# EAGLE design WEMOS_ESP8266_AktorShield (EAGLE 7.7.0)
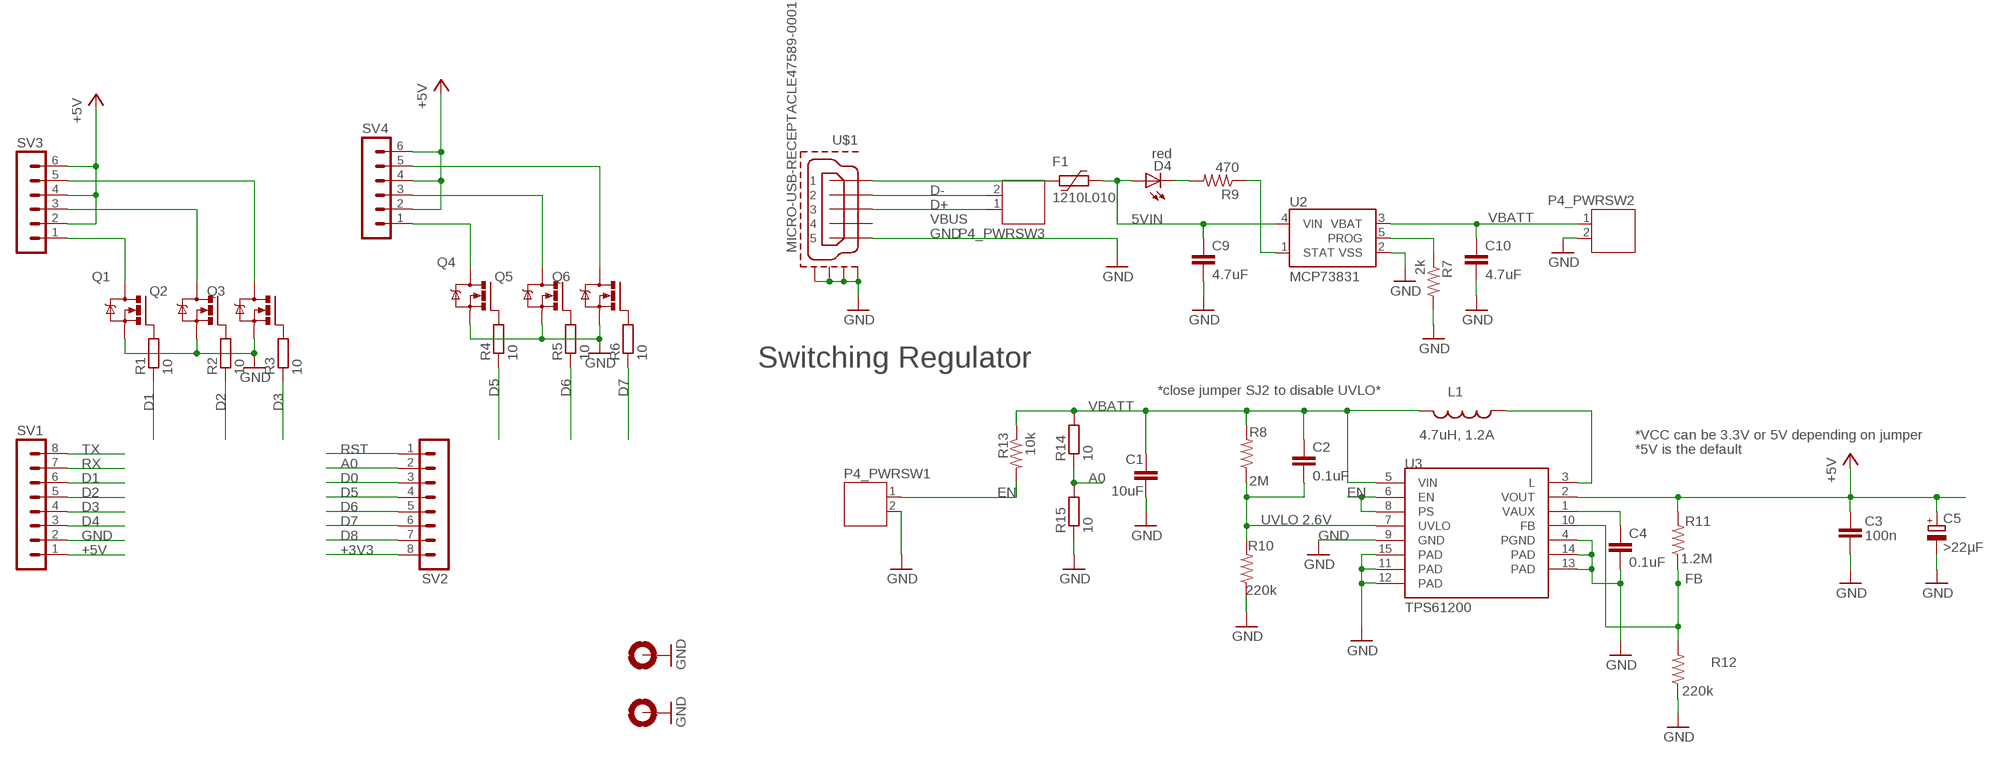
[diagram p0: schematic, sheet 1]

## Parts
C1  10uF  CAP1206  [1206]
C2  0.1uF  CAP0603-CAP  [0603-CAP]
C3  100n  CAP0805  [0805]
C4  0.1uF  CAP0603-CAP  [0603-CAP]
C5  >22µF  CPOL-EUSMCC  [SMC_C]
C9  4.7uF  CAP0603-CAP  [0603-CAP]
C10  4.7uF  CAP0603-CAP  [0603-CAP]
D4  red  LED0603  [LED-0603]
F1  1210L010  [1210L]
H7  MOUNT-PAD-ROUND3.6  [3,6-PAD]
H8  MOUNT-PAD-ROUND3.6  [3,6-PAD]
L1  4.7uH, 1.2A  INDUCTOR.  [CDRH2D09]
P4_PWRSW1  JST-PH2  [JST-PH2]
P4_PWRSW2  JST-PH2  [JST-PH2]
P4_PWRSW3  JST-PH2  [JST-PH2]
Q1  IRLML6344  [SOT23]
Q2  IRLML6344  [SOT23]
Q3  IRLML6344  [SOT23]
Q4  IRLML6344  [SOT23]
Q5  IRLML6344  [SOT23]
Q6  IRLML6344  [SOT23]
R1  10  R-EU_R0603  [R0603]
R2  10  R-EU_R0603  [R0603]
R3  10  R-EU_R0603  [R0603]
R4  10  R-EU_R0603  [R0603]
R5  10  R-EU_R0603  [R0603]
R6  10  R-EU_R0603  [R0603]
R7  2k  RESISTOR0603-RES  [0603-RES]
R8  2M  RESISTOR0603-RES  [0603-RES]
R9  470  RESISTOR0603-RES  [0603-RES]
R10  220k  RESISTOR0603-RES  [0603-RES]
R11  1.2M  RESISTOR0603-RES  [0603-RES]
R12  220k  RESISTOR0603-RES  [0603-RES]
R13  10k  RESISTOR0603-RES  [0603-RES]
R14  10  R-EU_R0603  [R0603]
R15  10  R-EU_R0603  [R0603]
SV1  MA08-1SMALL  [MA08-1S]
SV2  MA08-1SMALL  [MA08-1S]
SV3  MA06-1  [MA06-1]
SV4  MA06-1  [MA06-1]
U2  MCP73831  [SOT23-5]
U3  TPS61200  [QFN-10_PAD]
U$1  MICRO-USB-RECEPTACLE47589-0001  [47589-0001]

## Nets
5VIN: C9.1 D4.A F1.1 U2.4(VIN)
+3V3: SV2.8
+5V: C3.1 C5.+ R11.2 SV1.1 SV3.2 SV3.4 SV3.6 SV4.2 SV4.4 SV4.6 U3.2(VOUT)
A0: R14.1 R15.2 SV2.2
D0: SV2.3
D1: R1.1 SV1.6
D2: R2.1 SV1.5
D3: R3.1 SV1.4
D4: SV1.3
D5: R4.1 SV2.4
D6: R5.1 SV2.5
D7: R6.1 SV2.6
D8: SV2.7
D+: P4_PWRSW3.1 U$1.3
D-: P4_PWRSW3.2 U$1.2
EN: P4_PWRSW1.1 R13.2 U3.6(EN) U3.8(PS)
FB: R11.1 R12.2 U3.10(FB)
GND: C1.2 C3.2 C4.2 C5.- C9.2 C10.2 H7.B3,6(MOUNT) H8.B3,6(MOUNT) P4_PWRSW1.2 P4_PWRSW2.2 Q1.2(S) Q2.2(S) Q3.2(S) Q4.2(S) Q5.2(S) Q6.2(S) R7.2 R10.1 R12.1 R15.1 SV1.2 U2.2(VSS) U3.4(PGND) U3.9(GND) U3.11(PAD) U3.12(PAD) U3.13(PAD) U3.14(PAD) U3.15(PAD) U$1.5 U$1.CASING1(GND1) U$1.CASING2(GND2) U$1.CASING3(GND3) U$1.CASING4(GND4)
N$1: Q1.1(G) R1.2
N$2: Q2.1(G) R2.2
N$3: Q3.1(G) R3.2
N$4: Q3.3(D) SV3.5
N$5: Q1.3(D) SV3.1
N$6: Q2.3(D) SV3.3
N$7: Q4.1(G) R4.2
N$8: Q5.1(G) R5.2
N$9: Q6.1(G) R6.2
N$10: Q4.3(D) SV4.1
N$11: Q5.3(D) SV4.3
N$12: Q6.3(D) SV4.5
N$13: R7.1 U2.5(PROG)
N$14: R9.1 U2.1(STAT)
N$15: D4.C R9.2
N$16: L1.P$1 U3.3(L)
N$17: C4.1 U3.1(VAUX)
RST: SV2.1
RX: SV1.7
TX: SV1.8
UVLO: C2.2 R8.1 R10.2 U3.7(UVLO)
VBATT: C1.1 C2.1 C10.1 L1.P$2 P4_PWRSW2.1 R8.2 R13.1 R14.2 U2.3(VBAT) U3.5(VIN)
VBUS: F1.2 U$1.1
Unconnected: U$1.4

## Notes on the sheet
- Switching Regulator
- *close jumper SJ2 to disable UVLO*
- *VCC can be 3.3V or 5V depending on jumper
- *5V is the default
- UVLO 2.6V

## Library data of the parts
C1 = CH_passive:CAP: Capacitor Standard 0603 ceramic capacitor, and 0.1" leaded capacitor.; MF: KEMET; MPN: C1206C106K8RACTU; OC_FARNELL: 1288264
C2 C4 = SparkFun:CAP: Capacitor Standard 0603 ceramic capacitor, and 0.1" leaded capacitor.; MF: YAGEO (PHYCOMP); MPN: CC0603MRY5V9BB104; OC_FARNELL: 431989
C3 = CH_passive:CAP: Capacitor Standard 0603 ceramic capacitor, and 0.1" leaded capacitor.; MF: YAGEO (PHYCOMP); MPN: CC0603MRY5V9BB104; OC_FARNELL: 431989
C5 = rcl:CPOL-EU: POLARIZED CAPACITOR, European symbol
C9 C10 = SparkFun:CAP: Capacitor Standard 0603 ceramic capacitor, and 0.1" leaded capacitor.; MF: KEMET; MPN: C0603C475K8PACTU; OC_FARNELL: 1572625
D4 = SparkFun:LED: LEDs Standard schematic elements and footprints for 5mm, 3mm, 1206, and 0603 sized LEDs. 5mm - Spark Fun Electronics SKU : COM-00529 (and others); MF: OSRAM; MPN: LSQ976-Z; OC_FARNELL: 1226390
F1 = polyfuse-smd_10:?: Polyfuse Resettable PTC Source: http://www.littelfuse.com/products/resettable-ptcs.aspx; MF: LITTELFUSE; MPN: 1210L010WR; OC_FARNELL: 1822206; OC_NEWARK: 18M4781
H7 H8 = holes_new:MOUNT-PAD-ROUND: MOUNTING PAD, round; OC_FARNELL: unknown
L1 = SparkFun:INDUCTOR: Inductors Basic Inductor/Choke - 0603 and 1206. Footprints are not proven and vary greatly between part numbers.; MF: MURATA; MPN: LQH3NPN4R7MJ0L; OC_FARNELL: 2219271
P4_PWRSW1-P4_PWRSW3 = jst-ph:JST-PH2; MF: JST (JAPAN SOLDERLESS TERMINALS); MPN: B2B-PH-K-S(LF)(SN); OC_FARNELL: 9491856
Q1-Q6 = myDBv7:IRLML6344; MF: INFINEON; MPN: IRLML6344TRPBF; OC_FARNELL: 1857299
R1-R6 R14 R15 = rcl:R-EU_: RESISTOR, European symbol; MF: VISHAY; MPN: CRCW060310R0FKEA; OC_FARNELL: 1469751
R7 = SparkFun:RESISTOR: Resistor Basic schematic elements and footprints for 0603, 1206, and PTH resistors.; MF: YAGEO (PHYCOMP); MPN: RC0603FR-072K2L.; OC_FARNELL: 9238522
R8 = SparkFun:RESISTOR: Resistor Basic schematic elements and footprints for 0603, 1206, and PTH resistors.; MF: KOA SPEER ELECTRONICS; MPN: RK73H1JTTD1204F; OC_FARNELL: 1811595
R9 = SparkFun:RESISTOR: Resistor Basic schematic elements and footprints for 0603, 1206, and PTH resistors.; MF: MULTICOMP; MPN: MCHP03W8F4700T5E; OC_FARNELL: 1576273
R10 R12 = SparkFun:RESISTOR: Resistor Basic schematic elements and footprints for 0603, 1206, and PTH resistors.; MF: MULTICOMP; MPN: MCHP03W8F2203T5E; OC_FARNELL: 1576314
R11 = SparkFun:RESISTOR: Resistor Basic schematic elements and footprints for 0603, 1206, and PTH resistors.; MF: MULTICOMP; MPN: MCMR06W2004FTL; OC_FARNELL: 2073340
R13 = SparkFun:RESISTOR: Resistor Basic schematic elements and footprints for 0603, 1206, and PTH resistors.; MF: MULTICOMP; MPN: MCMR06X1002FTL; OC_FARNELL: 2073349
SV1 SV2 = con-pin-header:MA08-1: PIN HEADER; OC_FARNELL: unknown
SV3 SV4 = con-pin-header:MA06-1: PIN HEADER; OC_FARNELL: unknown
U2 = SparkFun:MCP73831: Microchip's MCP73831 Miniature single cell, fully integrated Li-Ion, Li-polymer charge management controller http://ww1.microchip.com/downloads/en/DeviceDoc/21984a.pdf; MF: MICROCHIP; MPN: MCP73831T-2ACI/OT; OC_FARNELL: 1332158
U3 = SparkFun:TPS61200: DC to DC Booster; MF: TEXAS INSTRUMENTS; MPN: TPS61200DRCT; OC_FARNELL: 1471238
U$1 = con-molex-usb:MICRO-USB-RECEPTACLE: MICRO USB RECEPTACLES Micro-USB Receptacles, SMT, Lead-Free from MOLEX <http://www.molex.com/>. (C) 2014 Tomasz Boleslaw CEDRO, cederom@tlen.pl, http://www.tomek.cedro.info. Version 0.1 (2014-01-17): Initial release. Version 0.2 (2014-02-06): Updated 47589-0001 footprint pins/pads/milling. Following devices are included: 1. 47589-0001 Micro-USB AB Receptacle, Bottom Mount, SMT, Lead-Free <http://www.molex.com/molex/products/datasheet.jsp?part=active/0475890001_IO_CONNECTORS.xml> (Technical Drawing <http://www.molex.com/pdm_docs/sd/475890001_sd.pdf>).; MF: MOLEX; MPN: 47589-0001; OC_FARNELL: 1568023

## Board
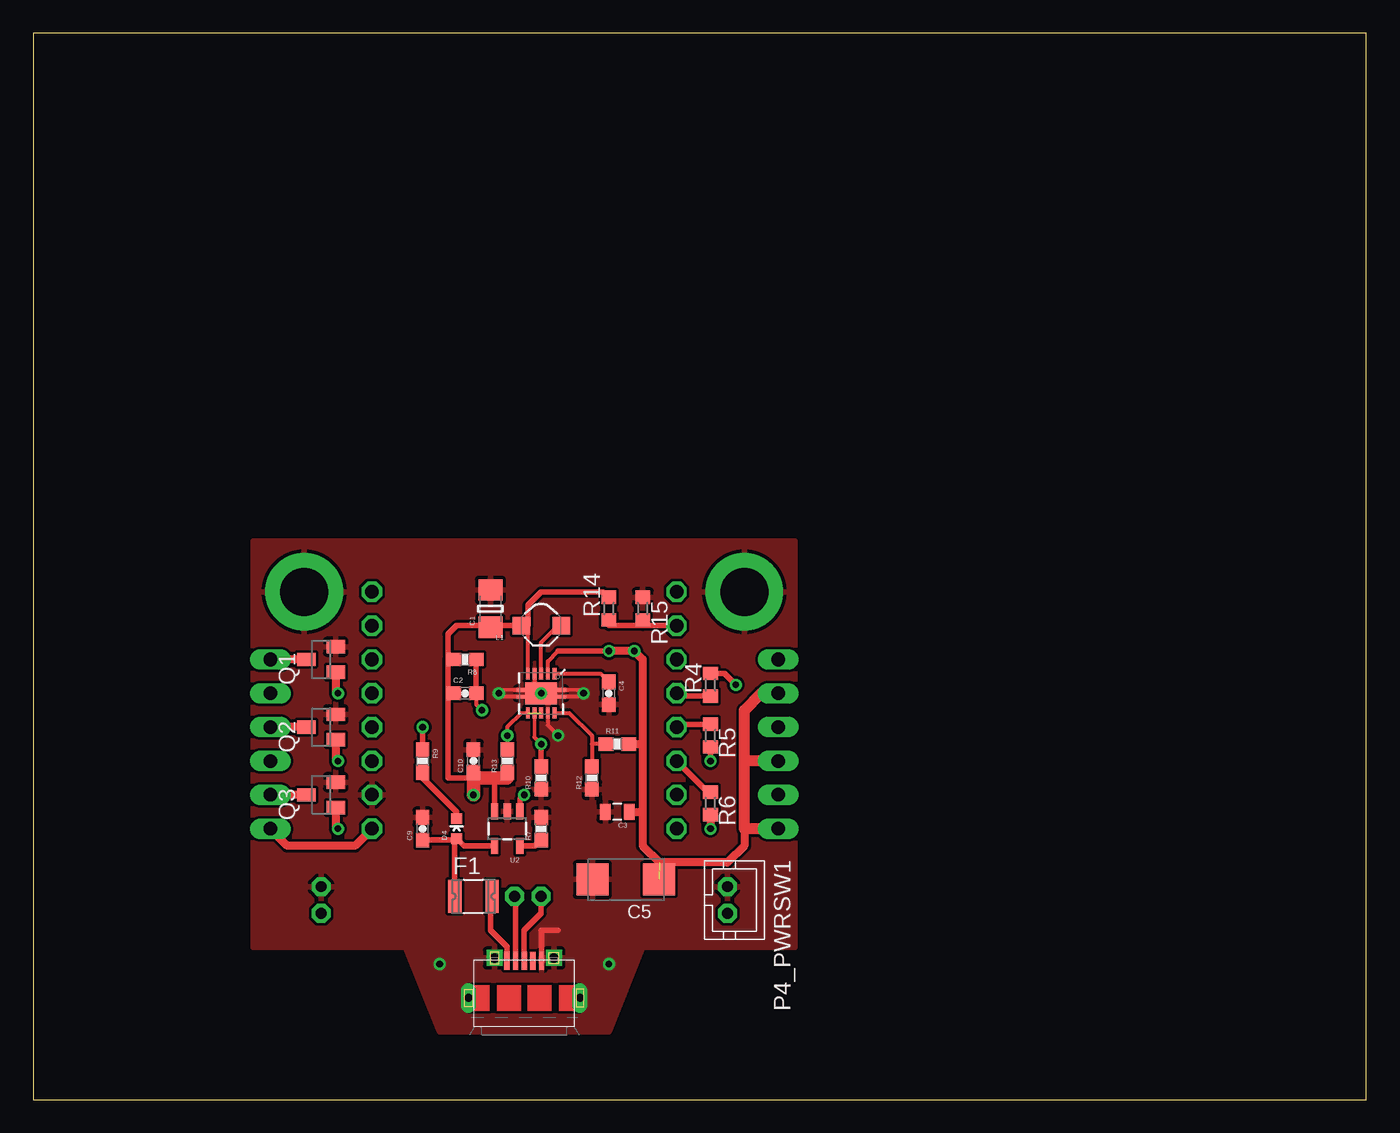
[diagram p1: board, top side]
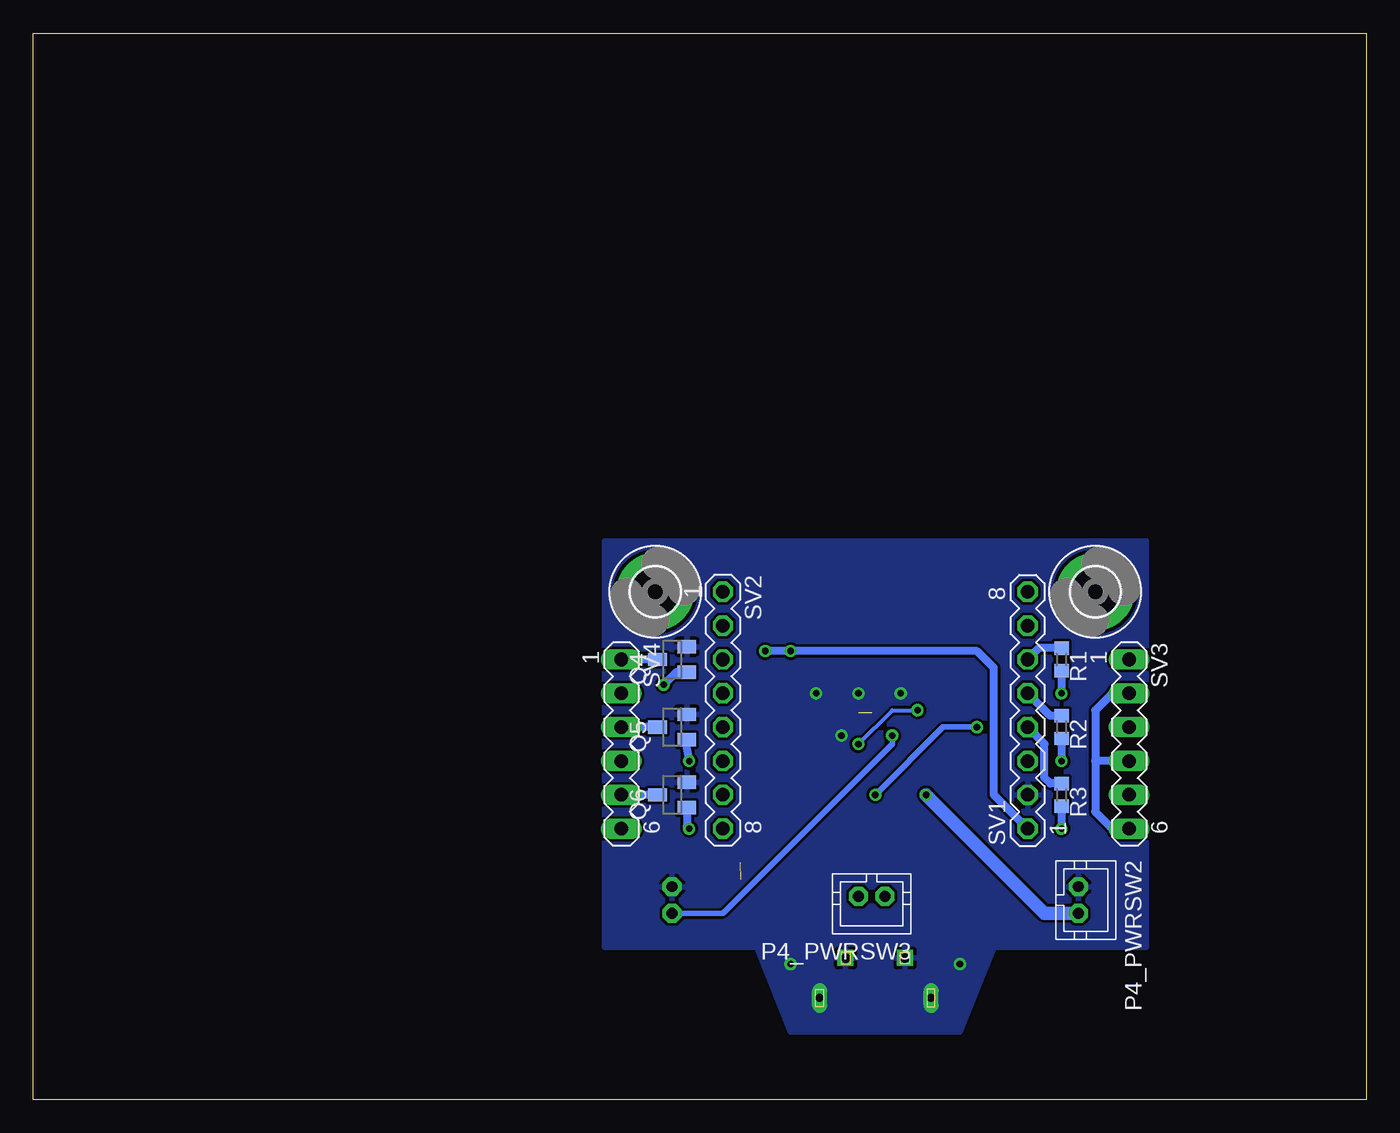
[diagram p2: board, bottom side, seen from below]

Size 100 x 80 mm. Coordinates in mm from the lower left corner, seen from the top.
Outline: 0,0 100,0 100,80 0,80 0,0
Copper layers (1*16): Top 0.035mm / dielectric 1.5mm / Bottom 0.035mm
Design rules "default": minimum track width 10mil, minimum drill 0.6mm, track to track 8mil, track to pad 8mil, pad to pad 8mil, via to via 8mil, smd to smd 8mil, copper to edge 40mil, drill to drill 8mil, minimum pad ring 10mil, minimum via ring 8mil, stop-mask expansion 4mil, vias tented up to drill 0mil, thermal gap 10mil

### Footprints (pad centres in the part's own frame; a part is rotated, then mirrored left to right if it is on the bottom)
1206 = smd 1.6 x 1.8: 1 -1.4,0; 2 1.4,0
0603-CAP = smd 1.1 x 1: 1 -0.85,0; 2 0.85,0
0805 = smd 0.8 x 1.2: 1 -0.9,0; 2 0.9,0
SMC_C = smd 2.4 x 2.4: + -2.5,0; - 2.5,0
LED-0603 = smd 0.8 x 0.8: A 0,-0.75; C 0,0.75
1210L = smd 1 x 2.5: 1 -1.4,0; 2 1.4,0
3,6-PAD = drill 3.6 pad 5.842: B3,6 0,0
CDRH2D09 = smd 1.3 x 1.3: P$1 -1.5,0; P$2 1.5,0
JST-PH2 = drill 0.813 pad 1.422 octagon: 1 0,0; 2 -2,0
SOT23 = smd 1 x 1.4: 1 -0.95,-1.1; 2 0.95,-1.1; 3 0,1.1
R0603 = smd 1 x 1.1: 1 -0.85,0; 2 0.85,0
0603-RES = smd 1.1 x 1: 1 -0.85,0; 2 0.85,0
MA08-1S = drill 1.016 octagon: 1 -8.89,0; 2 -6.35,0; 3 -3.81,0; 4 -1.27,0; 5 1.27,0; 6 3.81,0; 7 6.35,0; 8 8.89,0
MA06-1 = drill 1.016 long: 1 -6.35,0; 2 -3.81,0; 3 -1.27,0; 4 1.27,0; 5 3.81,0; 6 6.35,0
SOT23-5 = smd 0.55 x 1.2: 1 -0.95,-1.3; 2 0,-1.3; 3 0.95,-1.3; 4 0.95,1.3; 5 -0.95,1.3
QFN-10_PAD = smd 0.297 x 0.85: 1 -1,-1.475; 2 -0.5,-1.475; 3 0,-1.475; 4 0.5,-1.475; 5 1,-1.475; 6 1,1.475; 7 0.5,1.475; 8 0,1.475; 9 -0.5,1.475; 10 -1,1.475 | smd 0.7 x 0.28: 11 -1.5,0.25; 12 -1.5,-0.25; 13 1.5,0.25; 14 1.5,-0.25 | smd 2.4 x 1.65: 15 0,0
47589-0001 = smd 1.35 x 0.4: 1 2.8,1.3; 2 2.8,0.65; 3 2.8,0; 4 2.8,-0.65; 5 2.8,-1.3 | drill 0.6 pad 0.95 long: CASING1 0,4.175; CASING2 0,-4.175 | drill 0.7 pad 1.1 square: CASING3 3,2.225; CASING4 3,-2.225

### Placement (x,y rotation side)
C1  34.29,36.83 90 top
C2  32.38,30.48 0 top
C3  43.81,21.59 180 top
C4  43.18,30.48 270 top
C5  44.45,16.51 180 top
C9  29.21,20.32 90 top
C10  33.02,25.4 90 top
D4  31.75,20.32 0 top
F1  33.02,15.24 0 top
H7  53.34,38.1 0 bottom
H8  20.32,38.1 0 bottom
L1  38.1,35.56 180 top
P4_PWRSW1  52.07,13.97 270 top
P4_PWRSW2  21.59,13.97 270 bottom
P4_PWRSW3  38.1,15.24 180 bottom
Q1  21.59,33.02 90 top
Q2  21.59,27.94 90 top
Q3  21.59,22.86 90 top
Q4  52.07,33.02 90 bottom
Q5  52.07,27.94 90 bottom
Q6  52.07,22.86 90 bottom
R1  22.86,33.02 270 bottom
R2  22.86,27.94 270 bottom
R3  22.86,22.86 270 bottom
R4  50.8,31.11 90 top
R5  50.8,27.3 270 top
R6  50.8,22.23 270 top
R7  38.1,20.32 90 top
R8  32.38,33.02 180 top
R9  29.21,25.4 270 top
R10  38.1,24.13 90 top
R11  43.81,26.67 0 top
R12  41.91,24.13 90 top
R13  35.56,25.4 90 top
R14  43.18,36.83 90 top
R15  45.72,36.83 270 top
SV1  25.4,29.21 90 bottom
SV2  48.26,29.21 270 bottom
SV3  17.78,26.67 270 bottom
SV4  55.88,26.67 270 bottom
U2  35.56,20.32 180 top
U3  38.1,30.48 180 top
U$1  36.83,7.62 90 top

### Tracks (layer width: path | path; a pad name or v marks a point on that pad's centre or on a via)
5VIN
  Top 0.406: U2.4 32.3,19.02 D4.A | C9.1 31.65,19.47 D4.A | F1.1 31.62,19.44 D4.A
+5V  (via drill 0.5)  (1 unrouted)
  Top 0.305: U3.2 38.6,32.88 39.37,33.66
  Top 0.406: 39.37,33.66 v43.18,33.66
  Top 0.61: SV1.1 24.13,19.05 19.05,19.05 SV3.6 | 53.34,20.32 53.34,19.05 52.07,17.78 46.99,17.78 45.72,19.05 45.72,21.59 | 45.72,26.67 45.72,33.02 v45.09,33.66 v43.18,33.66 | 45.72,26.67 45.72,21.59 | R11.2 45.72,26.67 | C3.1 45.72,21.59
  Top 0.813: SV4.6 53.34,20.32 53.34,25.4 | 53.34,25.4 53.34,29.21 54.61,30.48 SV4.2 | SV4.4 53.34,25.4
  Bottom 0.61: SV3.2 19.05,30.48 20.32,29.21 20.32,25.4 | SV3.4 20.32,25.4 | 20.32,25.4 20.32,21.59 19.05,20.32 SV3.6 | SV1.1 27.94,22.86 27.94,32.38 29.21,33.66 v43.18,33.66 v45.09,33.66
A0
  Top 0.406: SV2.2 45.72,35.56 | 45.72,35.56 43.18,35.56 R14.1 | R15.2 45.72,35.56
D1
  Bottom 0.61: R1.1 24.55,33.87 SV1.6
D2
  Bottom 0.61: R2.1 23.71,28.79 SV1.5
D3
  Bottom 0.61: R3.1 23.71,23.71 24.13,24.13 24.13,26.67 SV1.4
D5
  Top 0.406: R4.1 48.48,30.27 SV2.4
D6
  Top 0.406: R5.1 48.48,28.16 SV2.5
D7
  Top 0.406: R6.1 50.59,23.07 SV2.6
D+
  Top 0.406: P4_PWRSW3.1 38.1,13.97 36.83,12.7 U$1.3
D-
  Top 0.406: U$1.2 36.18,15.16 P4_PWRSW3.2
EN  (via drill 0.5)  (1 unrouted)
  Top 0.254: U3.6 36.62,29
  Top 0.305: 36.62,29 35.56,27.94 v35.56,27.3 R13.2
  Bottom 0.406: P4_PWRSW1.1 48.26,13.97 35.56,26.67 v35.56,27.3
FB
  Top 0.305: U3.10 40.21,29 41.91,27.3 41.91,26.67 | 41.91,26.67 R12.2 | R11.1 41.91,26.67
GND  (via drill 0.5)
  Top 0.254: U3.9 38.6,28.07 | U3.13 35.17,30.23 v34.92,30.48 35.17,30.73 U3.14 | U3.11 41.02,30.23 v41.27,30.48 41.02,30.73 U3.12
  Top 0.305: 38.6,28.07 v39.37,27.3 | U3.4 37.6,30.98 U3.15 38.35,30.73 U3.12
  Top 0.406: U$1.5 38.13,12.67 38.1,12.7 39.37,12.7
  other vias: 38.1,30.48 43.18,10.16 30.48,10.16
  pour Bottom: 57.15,41.91 16.51,41.91 16.51,11.43 27.94,11.43 30.48,5.08 43.18,5.08 45.72,11.43 57.15,11.43
  pour Top: 57.15,41.91 16.51,41.91 16.51,11.43 27.94,11.43 30.48,5.08 43.18,5.08 45.72,11.43 57.15,11.43
N$1  (via drill 0.5)
  Top 0.61: Q1.1 22.69,30.65 v22.86,30.48
  Bottom 0.61: R1.2 v22.86,30.48
N$2  (via drill 0.5)
  Top 0.61: Q2.1 22.69,25.57 v22.86,25.4
  Bottom 0.61: R2.2 v22.86,25.4
N$3  (via drill 0.5)
  Top 0.61: Q3.1 22.69,20.49 v22.86,20.32
  Bottom 0.61: R3.2 v22.86,20.32
N$4
  Top 0.61: Q3.3 SV3.5
N$5
  Top 0.61: Q1.3 SV3.1
N$6
  Top 0.61: Q2.3 SV3.3
N$7  (via drill 0.5)
  Top 0.406: R4.2 51.85,31.96 v52.7,31.11
  Bottom 0.61: Q4.1 51.75,32.07 v52.7,31.11
N$8  (via drill 0.5)
  Top 0.406: R5.2 v50.8,25.4
  Bottom 0.61: Q5.1 51.12,26.99 v50.8,25.4
N$9  (via drill 0.5)
  Top 0.61: R6.2 v50.8,20.32
  Bottom 0.61: Q6.1 50.97,20.49 v50.8,20.32
N$10
  Bottom 0.61: Q4.3 SV4.1
N$11
  Bottom 0.61: Q5.3 SV4.3
N$12
  Bottom 0.61: Q6.3 SV4.5
N$13
  Top 0.406: U2.5 37.65,19.02 R7.1
N$14  (via drill 0.5)
  Top 0.406: U2.1 36.51,22.54 v36.83,22.86 | R9.1 v29.21,27.94
  Bottom 0.406: v29.21,27.94 31.75,27.94 v36.83,22.86
N$15
  Top 0.406: D4.C 31.75,21.59 29.21,24.13 R9.2
N$16
  Top 0.305: U3.3 38.1,34.29 39.37,35.56 39.37,35.33 L1.P$1
N$17
  Top 0.305: U3.1 42.55,31.95 C4.1
UVLO  (via drill 0.5)
  Top 0.254: U3.7 37.6,27.17
  Top 0.305: 37.6,27.17 v38.1,26.67 | C2.2 33.23,29.63 v33.66,29.21
  Top 0.406: R10.2 v38.1,26.67 | R8.1 C2.2
  Bottom 0.305: v38.1,26.67 35.56,29.21 v33.66,29.21
VBATT  (via drill 0.5)
  Top 0.305: U3.5 37.1,35.56
  Top 0.406: U2.3 34.61,23.81 34.29,24.13 | R13.1 35.56,24.13 | 33.02,24.13 31.11,24.13 31.11,30.48 | 31.11,30.48 31.11,33.02 | L1.P$2 31.75,35.56 31.11,34.92 31.11,33.02 | 31.11,33.02 R8.2 31.75,33.02 | C1.1 34.29,35.56 L1.P$2 | L1.P$2 36.83,35.56 36.7,35.66 | 36.7,35.66 L1.P$2 | C2.1 31.11,30.48 | R14.2 42.76,38.1 38.1,38.1 37.1,37.1 37.1,35.56 37,35.66 36.7,35.66
  Top 1.016: 35.56,24.13 34.29,24.13 33.02,24.13 | C10.1 33.02,24.13 | 33.02,24.13 v33.02,22.86
  Bottom 1.016: P4_PWRSW2.1 24.13,13.97 v33.02,22.86
VBUS
  Top 0.406: F1.2 34.29,15.11 34.29,12.7 35.53,11.46 U$1.1